# Altium schematic sheet 硬件电路.SchDoc
size A3; SheetNumber: 0; SheetTotal: 0
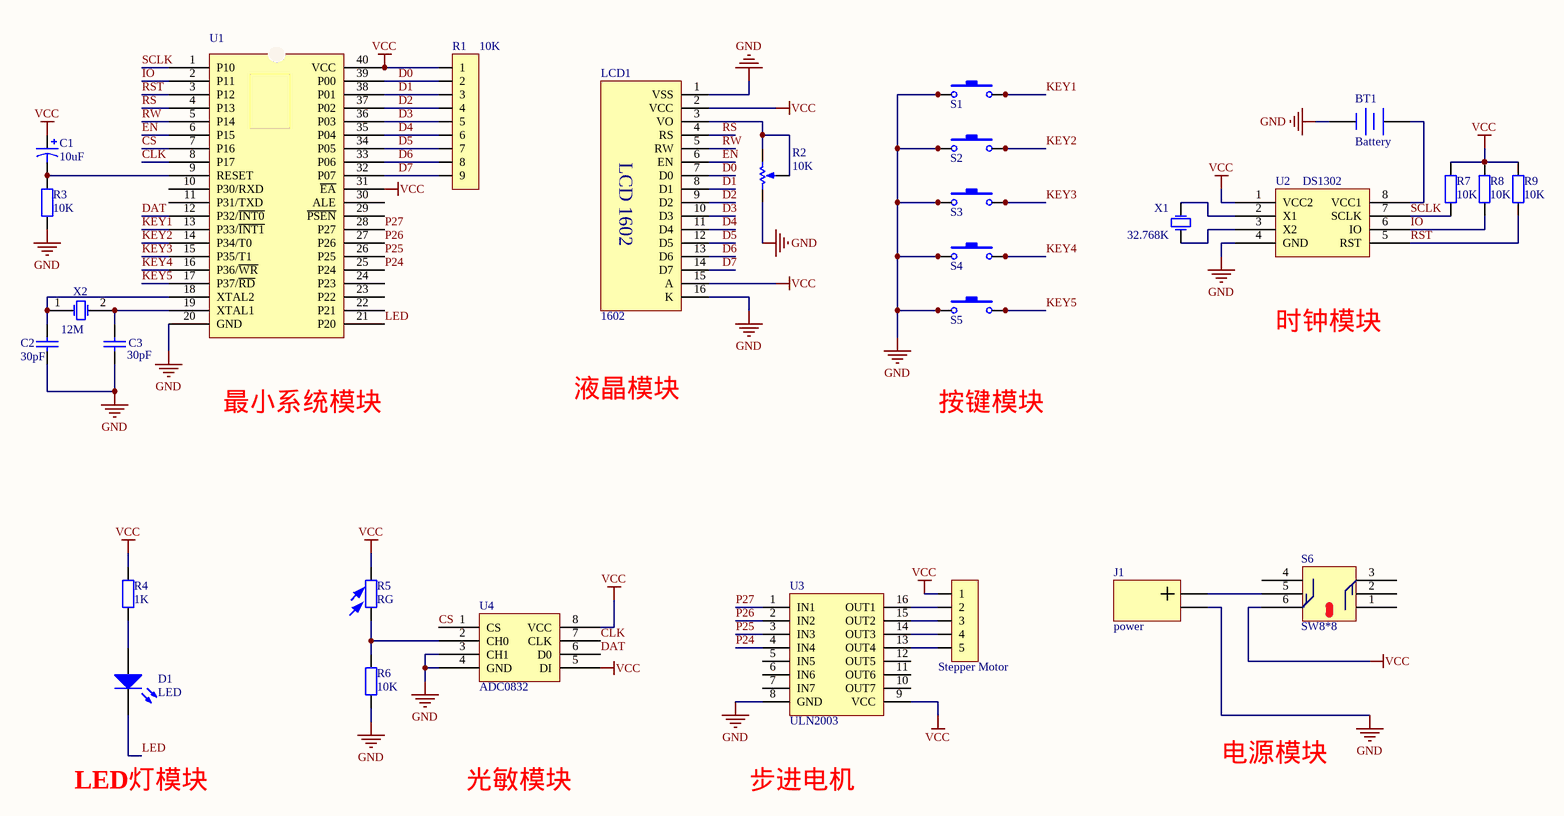
[diagram p0: 硬件电路.SchDoc]

## Parts
BT1  Battery  [DCZ--DCBT_3V]
C1  10uF  [DR--CRB-2.54/5MM]
C2  30pF  [DR--CCP-4X5]
C3  30pF  [DR--CCP-4X5]
D1  LED  [EJG--LED5mm]
J1  power  [DYZ--DC002]
J2  Stepper Motor  [HDR1X5]
LCD1  1602  [YJ--LCD1602]
R1  10K  [DZ--Rpz09]
R2  10K  [DZ--R065]
R3  10K  [DZ--RAXIAL-0.4_D]
R4  1K  [DZ--RAXIAL-0.4_D]
R5  RG  [DZ--RGL5506]
R6  10K  [DZ--RAXIAL-0.4_D]
R7  10K  [DZ--RAXIAL-0.4_D]
R8  10K  [DZ--RAXIAL-0.4_D]
R9  10K  [DZ--RAXIAL-0.4_D]
S1  AJ--SW-PB  [SW6*6*5]  (value not drawn)
S2  AJ--SW-PB  [SW6*6*5]  (value not drawn)
S3  AJ--SW-PB  [SW6*6*5]  (value not drawn)
S4  AJ--SW-PB  [SW6*6*5]  (value not drawn)
S5  AJ--SW-PB  [SW6*6*5]  (value not drawn)
S6  SW8*8  [KG--SW8*8]
U1  MCU  [ICZ--DIP40]  (value not drawn)
U2  DS1302  [ICZ--DIP8]
U3  ULN2003  [DIP16]
U4  ADC0832  [ICZ--DIP8]
W  WYB--  [WYB--M9X15cm]  (value not drawn)
X1  32.768K  [JZ--XTAL3]
X2  12M  [JZ--XTAL1]

## Nets
GND: BT1.2(-) C2.1 C3.1 J1.2 LCD1.1(VSS) LCD1.16(K) R2.1 R3.1 R6.1 S1.1 S1.3 S2.1 S2.3 S3.1 S3.3 S4.1 S4.3 S5.1 S5.3 U1.20(GND) U2.4(GND) U3.8(GND) U4.3(CH1) U4.4(GND)
VCC: C1.1 J2.1 LCD1.2(VCC) LCD1.15(A) R1.1 R4.2 R5.2 R7.1 R8.1 R9.1 S6.6 U1.31(~{EA}) U1.40(VCC) U2.1(VCC2) U3.9(VCC) U4.5(DI) U4.8(VCC)
CLK: U1.8(P17) U4.7(CLK)
CS: U1.7(P16) U4.1(CS)
D0: LCD1.7(D0) R1.2 U1.39(P00)
D1: LCD1.8(D1) R1.3 U1.38(P01)
D2: LCD1.9(D2) R1.4 U1.37(P02)
D3: LCD1.10(D3) R1.5 U1.36(P03)
D4: LCD1.11(D4) R1.6 U1.35(P04)
D5: LCD1.12(D5) R1.7 U1.34(P05)
D6: LCD1.13(D6) R1.8 U1.33(P06)
D7: LCD1.14(D7) R1.9 U1.32(P07)
DAT: U1.12(P32/~{INT0}) U4.6(D0)
EN: LCD1.6(EN) U1.6(P15)
IO: R8.2 U1.2(P11) U2.6(IO)
KEY1: S1.2 S1.4 U1.13(P33/~{INT1})
KEY2: S2.2 S2.4 U1.14(P34/T0)
KEY3: S3.2 S3.4 U1.15(P35/T1)
KEY4: S4.2 S4.4 U1.16(P36/~{WR})
KEY5: S5.2 S5.4 U1.17(P37/~{RD})
LED: D1.2 U1.21(P20)
P24: U1.25(P24) U3.4(IN4)
P25: U1.26(P25) U3.3(IN3)
P26: U1.27(P26) U3.2(IN2)
P27: U1.28(P27) U3.1(IN1)
RS: LCD1.4(RS) U1.4(P13)
RST: R9.2 U1.3(P12) U2.5(RST)
RW: LCD1.5(RW) U1.5(P14)
SCLK: R7.2 U1.1(P10) U2.7(SCLK)
NetBT1_1: BT1.1(+) U2.8(VCC1)
NetC1_2: C1.2 R3.2 U1.9(RESET)
NetC2_2: C2.2 U1.18(XTAL2) X2.1(OSC1)
NetC3_2: C3.2 U1.19(XTAL1) X2.2(OSC2)
NetD1_1: D1.1 R4.1
NetJ1_1: J1.1 S6.5
NetJ2_2: J2.2 U3.16(OUT1)
NetJ2_3: J2.3 U3.15(OUT2)
NetJ2_4: J2.4 U3.14(OUT3)
NetJ2_5: J2.5 U3.13(OUT4)
NetLCD1_3: LCD1.3(VO) R2.2 R2.3
NetR5_1: R5.1 R6.2 U4.2(CH0)
NetU2_2: U2.2(X1) X1.2(OSC2)
NetU2_3: U2.3(X2) X1.1(OSC1)

Not connected (* = marked no-connect by the designer): S6 1 2 3 4; U1 10(P30/RXD) 11(P31/TXD) 22(P21) 23(P22) 24(P23) 29(~{PSEN}) 30(ALE); U3 5(IN5) 6(IN6) 7(IN7) 10(OUT7) 11(OUT6) 12(OUT5)

## Notes on the sheet
- 时钟模块
- 液晶模块
- 最小系统模块
- 按键模块
- LED灯模块
- 光敏模块
- 步进电机
- 电源模块
- (in symbol 1602) LCD 1602

## Library data of the parts
C1 = CAP_2
C2 C3 = CAP
J1 = DC5.5
J2 = HEARDER5
R1 = Header9
R2 = RES-B
R3 R4 R6-R9 = Res
S1-S5 = AJ--SW-PB: Switch; Published: 24-Mar-1999; LatestRevisionDate: 17-Jul-2002; LatestRevisionNote: Re-released for DXP Platform.; PackageReference: SPST-2; Publisher: Altium Limited
S6 = KG--SW8*8: 自锁开关
U1 = STC89C52
W = WYB--: WYB
X1 X2 = XTAL